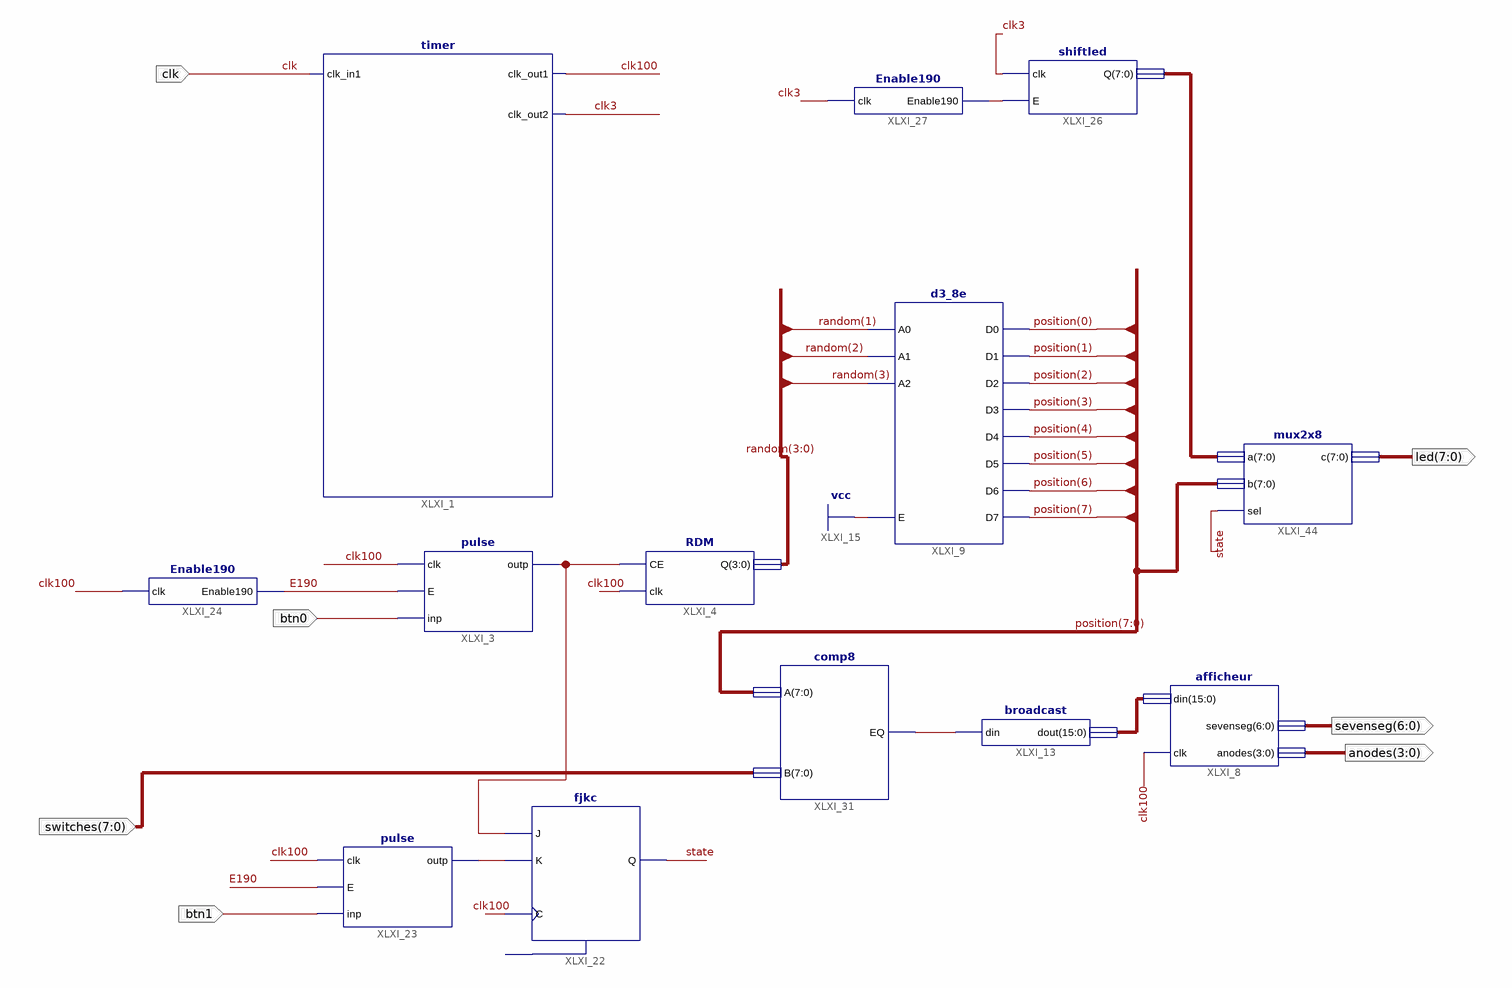
[diagram p0: schematic sheet 1]
// Xilinx ISE schematic toplevel.sch (spartan6) as structural Verilog: 13 symbols, 7 ports
module toplevel (
  input  clk,
  input  btn0,
  input  [7:0] switches,
  input  btn1,
  output [7:0] led,
  output [6:0] sevenseg,
  output [3:0] anodes
);

  wire clk3, clk100, E190, state, XLXN_31, XLXN_68, XLXN_69, XLXN_77;
  wire [3:0] random;
  wire [7:0] position, XLXN_81;
  wire [15:0] XLXN_30;

  timer XLXI_1 (.clk_in1(clk), .clk_out1(clk100), .clk_out2(clk3));
  d3_8e XLXI_9 (
    .A0(random[1]), .A1(random[2]), .A2(random[3]), .E(1'b1), .D0(position[0]), .D1(position[1]),
    .D2(position[2]), .D3(position[3]), .D4(position[4]), .D5(position[5]), .D6(position[6]), .D7(position[7]));
  pulse XLXI_3 (.clk(clk100), .E(E190), .inp(btn0), .outp(XLXN_68));
  RDM XLXI_4 (.CE(XLXN_68), .clk(clk100), .Q(random));
  Enable190 XLXI_24 (.clk(clk100), .Enable190(E190));
  shiftled XLXI_26 (.clk(clk3), .E(XLXN_77), .Q(XLXN_81));
  Enable190 XLXI_27 (.clk(clk3), .Enable190(XLXN_77));
  pulse XLXI_23 (.clk(clk100), .E(E190), .inp(btn1), .outp(XLXN_69));
  fjkc XLXI_22 (.C(clk100), .J(XLXN_68), .K(XLXN_69), .Q(state));  // open: CLR
  comp8 XLXI_31 (.A(position), .B(switches), .EQ(XLXN_31));
  afficheur XLXI_8 (.din(XLXN_30), .clk(clk100), .sevenseg(sevenseg), .anodes(anodes));
  broadcast XLXI_13 (.din(XLXN_31), .dout(XLXN_30));
  mux2x8 XLXI_44 (.a(XLXN_81), .b(position), .sel(state), .c(led));
endmodule
